# EAGLE design miliohmmeter (EAGLE 7.7.0)
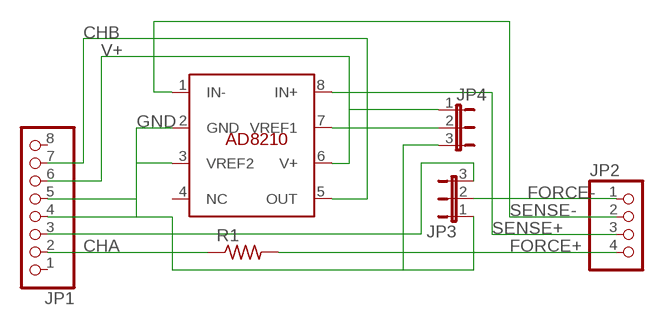
[diagram p0: schematic, sheet 1]

## Parts
JP1  PINHD-1X8  [1X08]
JP2  PINHD-1X4  [1X04]
JP3  JP2E  [JP2]
JP4  JP2E  [JP2]
R1  R-US_0207/10  [0207/10]
U1  AD8210  [SO8]

## Nets
CHA: JP1.2 R1.1
CHB: JP1.7 U1.5(OUT)
FORCE+: JP2.4 R1.2
FORCE-: JP2.1 JP3.2
GND: JP1.4 JP1.5 JP3.1 JP4.3 U1.2(GND) U1.3(VREF2)
N$9: JP1.3 JP3.3
N$10: JP4.2 U1.7(VREF1)
SENSE+: JP2.3 U1.8(IN+)
SENSE-: JP2.2 U1.1(IN-)
V+: JP1.6 JP4.1 U1.6(V+)
Unconnected: JP1.1 JP1.8 U1.4(NC)

## Library data of the parts
JP1 = pinhead:PINHD-1X8: PIN HEADER
JP2 = pinhead:PINHD-1X4: PIN HEADER
JP3 JP4 = jumper:JP2E: JUMPER
R1 = resistor:R-US_: RESISTOR, American symbol
U1 = analog-devices:AD8210: Current sense monitor

## Board
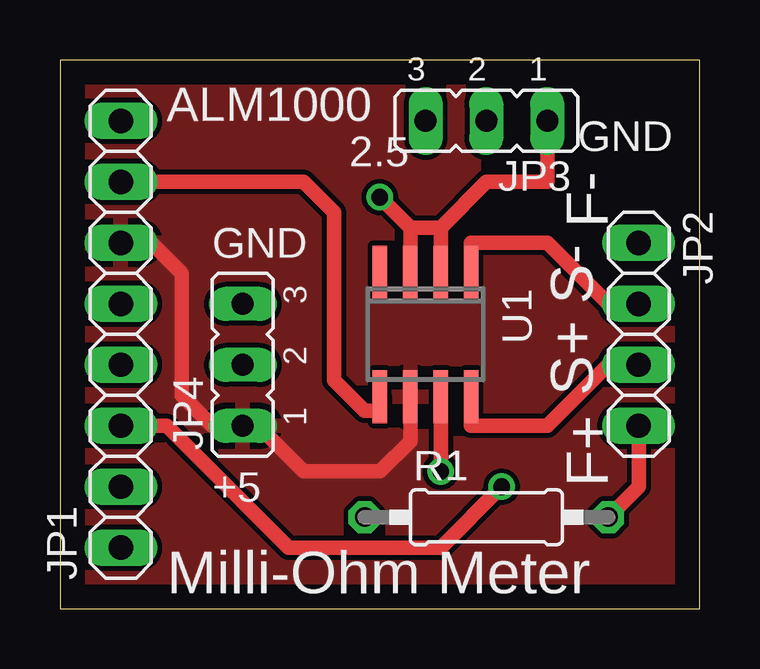
[diagram p1: board, top side]
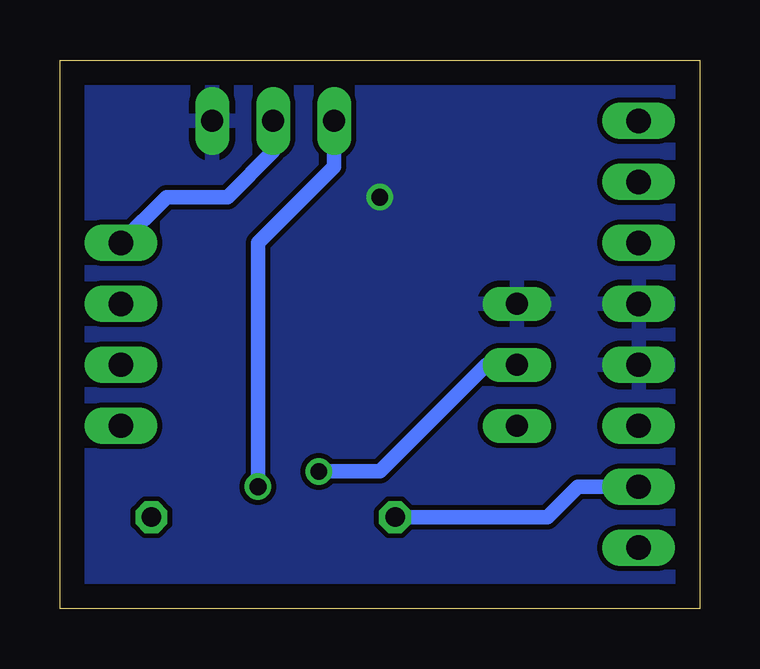
[diagram p2: board, bottom side, seen from below]

Size 26.67 x 22.86 mm. Coordinates in mm from the lower left corner, seen from the top.
Outline: 0,0 26.67,0 26.67,22.86 0,22.85 0,0
Copper layers (1*16): Top 0.035mm / dielectric 1.5mm / Bottom 0.035mm
Design rules "default": minimum track width 10mil, minimum drill 24mil, track to track 8mil, track to pad 8mil, pad to pad 8mil, via to via 8mil, smd to smd 8mil, copper to edge 40mil, drill to drill 8mil, minimum pad ring 10mil, minimum via ring 8mil, stop-mask expansion 4mil, vias tented up to drill 0mil, thermal gap 10mil

### Footprints (pad centres in the part's own frame; a part is rotated, then mirrored left to right if it is on the bottom)
1X08 = drill 1.016 long: 1 -8.89,0; 2 -6.35,0; 3 -3.81,0; 4 -1.27,0; 5 1.27,0; 6 3.81,0; 7 6.35,0; 8 8.89,0
1X04 = drill 1.016 long: 1 -3.81,0; 2 -1.27,0; 3 1.27,0; 4 3.81,0
JP2 = drill 0.914 long: 1 -2.54,0; 2 0,0; 3 2.54,0
0207/10 = drill 0.813 octagon: 1 -5.08,0; 2 5.08,0
SO8 = smd 0.6 x 2.2: 1 -1.905,-2.6; 2 -0.635,-2.6; 3 0.635,-2.6; 4 1.905,-2.6; 5 1.905,2.6; 6 0.635,2.6; 7 -0.635,2.6; 8 -1.905,2.6

### Placement (x,y rotation side)
JP1  2.54,11.43 90 top
JP2  24.13,11.43 270 top
JP3  17.78,20.32 180 top
JP4  7.62,10.16 90 top
R1  17.78,3.81 0 top
U1  15.24,11.43 180 top

### Tracks (layer width: path | path; a pad name or v marks a point on that pad's centre or on a via)
CHA
  Bottom 0.61: R1.1 6.35,3.81 5.08,5.08 JP1.2
CHB
  Top 0.61: U1.5 13.34,8.26 12.7,8.26 11.43,9.53 11.43,16.51 10.16,17.78 JP1.7
FORCE+
  Top 0.61: JP2.4 24.13,5.08 R1.2
FORCE-
  Bottom 0.61: JP3.2 17.78,19.05 19.68,17.14 22.23,17.14 JP2.1
GND  (via drill 0.7)
  Top 0.61: JP3.1 20.32,17.78 17.78,17.78 15.88,15.88 | 15.88,15.88 U1.2 | U1.3 14.61,15.88 | 14.61,15.88 15.88,15.88 | 14.61,15.88 v13.34,17.14
  pour Bottom: 0.64,0.64 26.04,0.64 26.04,22.23 0.64,22.23
N$9  (via drill 0.7)
  Top 0.61: v18.41,5.08 15.88,2.54 9.53,2.54 4.45,7.62 JP1.3
  Bottom 0.61: JP3.3 15.24,18.41 18.41,15.24 v18.41,5.08
N$10  (via drill 0.7)
  Top 0.61: U1.7 v15.88,5.71
  Bottom 0.61: v15.88,5.71 13.34,5.71 8.89,10.16 JP4.2
SENSE+
  Top 0.61: JP2.3 22.86,10.16 20.32,7.62 17.14,7.62 U1.8
SENSE-
  Top 0.61: JP2.2 22.86,12.7 20.32,15.24 17.14,15.24 U1.1
V+
  Top 0.61: U1.6 14.61,6.99 13.34,5.71 10.16,5.71 8.26,7.62 JP4.1 6.35,7.62 5.08,8.89 5.08,13.97 3.81,15.24 JP1.6
  pour Top: 0.64,0.64 0.64,22.23 26.04,22.23 26.04,0.64

### Text on the board
tPlace: ALM1000 | GND | 2.5 | F- | GND | S- | S+ | F+ | +5 | Milli-Ohm Meter